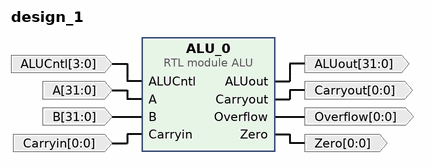
[diagram p0: block diagram of the top level]
# Vivado block design design_1, xc7k70tfbv676-1, Vivado 2021.1
create_bd_design design_1

create_bd_port -dir I -from 31 -to 0 -type data A
create_bd_port -dir I -from 31 -to 0 -type data B
create_bd_port -dir I -from 3 -to 0 -type data ALUCntl
create_bd_port -dir I -from 0 -to 0 -type data Carryin
create_bd_port -dir O -from 31 -to 0 -type data ALUout
create_bd_port -dir O -from 0 -to 0 -type data Zero
create_bd_port -dir O -from 0 -to 0 -type data Carryout
create_bd_port -dir O -from 0 -to 0 -type data Overflow

create_bd_cell -type module -reference ALU ALU_0

# ---- connections ----

connect_bd_net [get_bd_ports ALUCntl] [get_bd_pins ALU_0/ALUCntl]
connect_bd_net [get_bd_pins ALU_0/ALUout] [get_bd_ports ALUout]
connect_bd_net [get_bd_pins ALU_0/Carryout] [get_bd_ports Carryout]
connect_bd_net [get_bd_pins ALU_0/Overflow] [get_bd_ports Overflow]
connect_bd_net [get_bd_pins ALU_0/Zero] [get_bd_ports Zero]
connect_bd_net [get_bd_ports A] [get_bd_pins ALU_0/A]
connect_bd_net [get_bd_ports B] [get_bd_pins ALU_0/B]
connect_bd_net [get_bd_ports Carryin] [get_bd_pins ALU_0/Carryin]

validate_bd_design
save_bd_design
